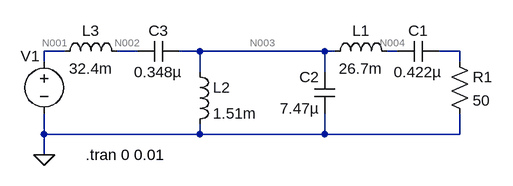
[diagram p0: schematic cheBPF.asc]
cheBPF.asc, the LTspice schematic file:
Version 4
SHEET 1 1044 680
WIRE 288 256 256 256
WIRE 400 256 368 256
WIRE 496 256 464 256
WIRE 688 256 496 256
WIRE 704 256 688 256
WIRE 800 256 784 256
WIRE 896 256 864 256
WIRE 256 272 256 256
WIRE 896 272 896 256
WIRE 496 288 496 256
WIRE 688 288 688 256
WIRE 256 384 256 352
WIRE 496 384 496 368
WIRE 496 384 256 384
WIRE 688 384 688 352
WIRE 688 384 496 384
WIRE 896 384 896 352
WIRE 896 384 688 384
WIRE 256 416 256 384
FLAG 256 416 0
SYMBOL res 880 256 R0
SYMATTR InstName R1
SYMATTR Value 50
SYMBOL ind 480 272 R0
SYMATTR InstName L2
SYMATTR Value 1.51m
SYMBOL cap 864 240 R90
WINDOW 0 0 32 VBottom 2
WINDOW 3 32 32 VTop 2
SYMATTR InstName C1
SYMATTR Value 0.422µ
SYMBOL voltage 256 256 R0
WINDOW 123 -60 107 Left 2
WINDOW 3 24 38 Invisible 2
WINDOW 0 -36 7 Left 2
WINDOW 39 0 0 Left 2
SYMATTR Value PULSE(0 1 0 1e-50 1e-50 1 2)
SYMATTR InstName V1
SYMBOL cap 704 352 R180
WINDOW 0 24 56 Left 2
WINDOW 3 24 8 Left 2
SYMATTR InstName C2
SYMATTR Value 7.47µ
SYMBOL cap 464 240 R90
WINDOW 0 0 32 VBottom 2
WINDOW 3 32 32 VTop 2
SYMATTR InstName C3
SYMATTR Value 0.348µ
SYMBOL ind 688 272 R270
WINDOW 0 32 56 VTop 2
WINDOW 3 5 56 VBottom 2
SYMATTR InstName L1
SYMATTR Value 26.7m
SYMBOL ind 272 272 R270
WINDOW 0 32 56 VTop 2
WINDOW 3 5 56 VBottom 2
SYMATTR InstName L3
SYMATTR Value 32.4m
TEXT 320 416 Left 2 !.tran 0 0.01

The netlist it stands for:
* cheBPF.asc
R1 N005 0 50
L2 N003 0 1.51m
C1 N005 N004 0.422µ
V1 N001 0 PULSE(0 1 0 1e-50 1e-50 1 2)
C2 0 N003 7.47µ
C3 N003 N002 0.348µ
L1 N003 N004 26.7m
L3 N001 N002 32.4m
.tran 0 0.01
.backanno
.end

* Results of the author's LTspice run, read from the files saved beside the schematic
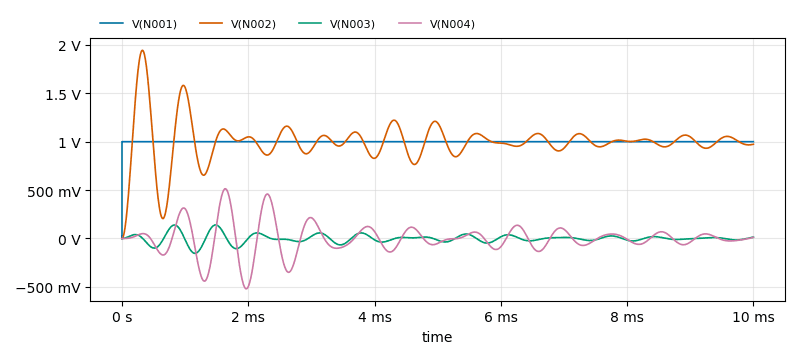
[diagram p1: Transient Analysis of cheBPF.asc, plotted from the saved traces]
* Transient Analysis, 1 run:
*   V(N001): min 0 V, max 1 V, average 1 V, rms 1 V, last 1 V
*   V(N002): min 0 V, max 1.943 V, average 999.9 mV, rms 1.023 V, last 973.2 mV
*   V(N003): min -153.5 mV, max 140.1 mV, average -108 µV, rms 43.23 mV, last 13.76 mV
*   V(N004): min -519.6 mV, max 513.9 mV, average -285.5 µV, rms 153.7 mV, last 11.43 mV